# Altium schematic sheet PCB_TrafficLight - Copy.SchDoc
size A1; SheetNumber: 1; SheetTotal: 1; SPICEModelCacheFLOYLRYA: <root> / <DocumentId>FLOYLRYA</DocumentId> / <CacheFrame Number="0"> / <Model Name="hdsp_311a" Kind="CKT"> / <Text>* / * Diode Model Produced by Altium Ltd / * Date:  10-Mar-2004 / * / * Manufacturer: Agilent / * Component Name: HDSP-311A / * / * Parameters derived from information available in data sheet. / * / *                 cathode-A / *                 |  cathode-F / *                 |  |  common-anode / *                 |  |  |  cathode-E / *                 |  |  |  |  cathode-D / *                 |  |  |  |  |  cathode-DP / *                 |  |  |  |  |  |  cathode-C / *                 |  |  |  |  |  |  |  cathode-G / *                 |  |  |  |  |  |  |  |  cathode-B / *                 |  |  |  |  |  |  |  |  |  common-anode / *                 |  |  |  |  |  |  |  |  |  | / .SUBCKT HDSP_311A 1  2  3  7  8  9  10 11 13 14 / DA1   3  1 dHDSP_311A / DB1   3 13 dHDSP_311A / DC1   3 10 dHDSP_311A / DD1   3  8 dHDSP_311A / DE1   3  7 dHDSP_311A / DF1   3  2 dHDSP_311A / DG1   3 11 dHDSP_311A / DDP1  3  9 dHDSP_311A / DA2  14  1 dHDSP_311A / DB2  14 13 dHDSP_311A / DC2  14 10 dHDSP_311A / DD2  14  8 dHDSP_311A / DE2  14  7 dHDSP_311A / DF2  14  2 dHDSP_311A / DG2  14 11 dHDSP_311A / DDP2 14  9 dHDSP_311A / .MODEL dHDSP_311A D / + ( / +    IS  = 4.92088043E-22 / +     N  = 1.51994259 / +    RS  = 3.79496255 / +    BV  = 4.5 / +   IBV  = 100u / + ) / .ENDS HDSP_311A</Text> / </Model> / </CacheFrame> / </root>
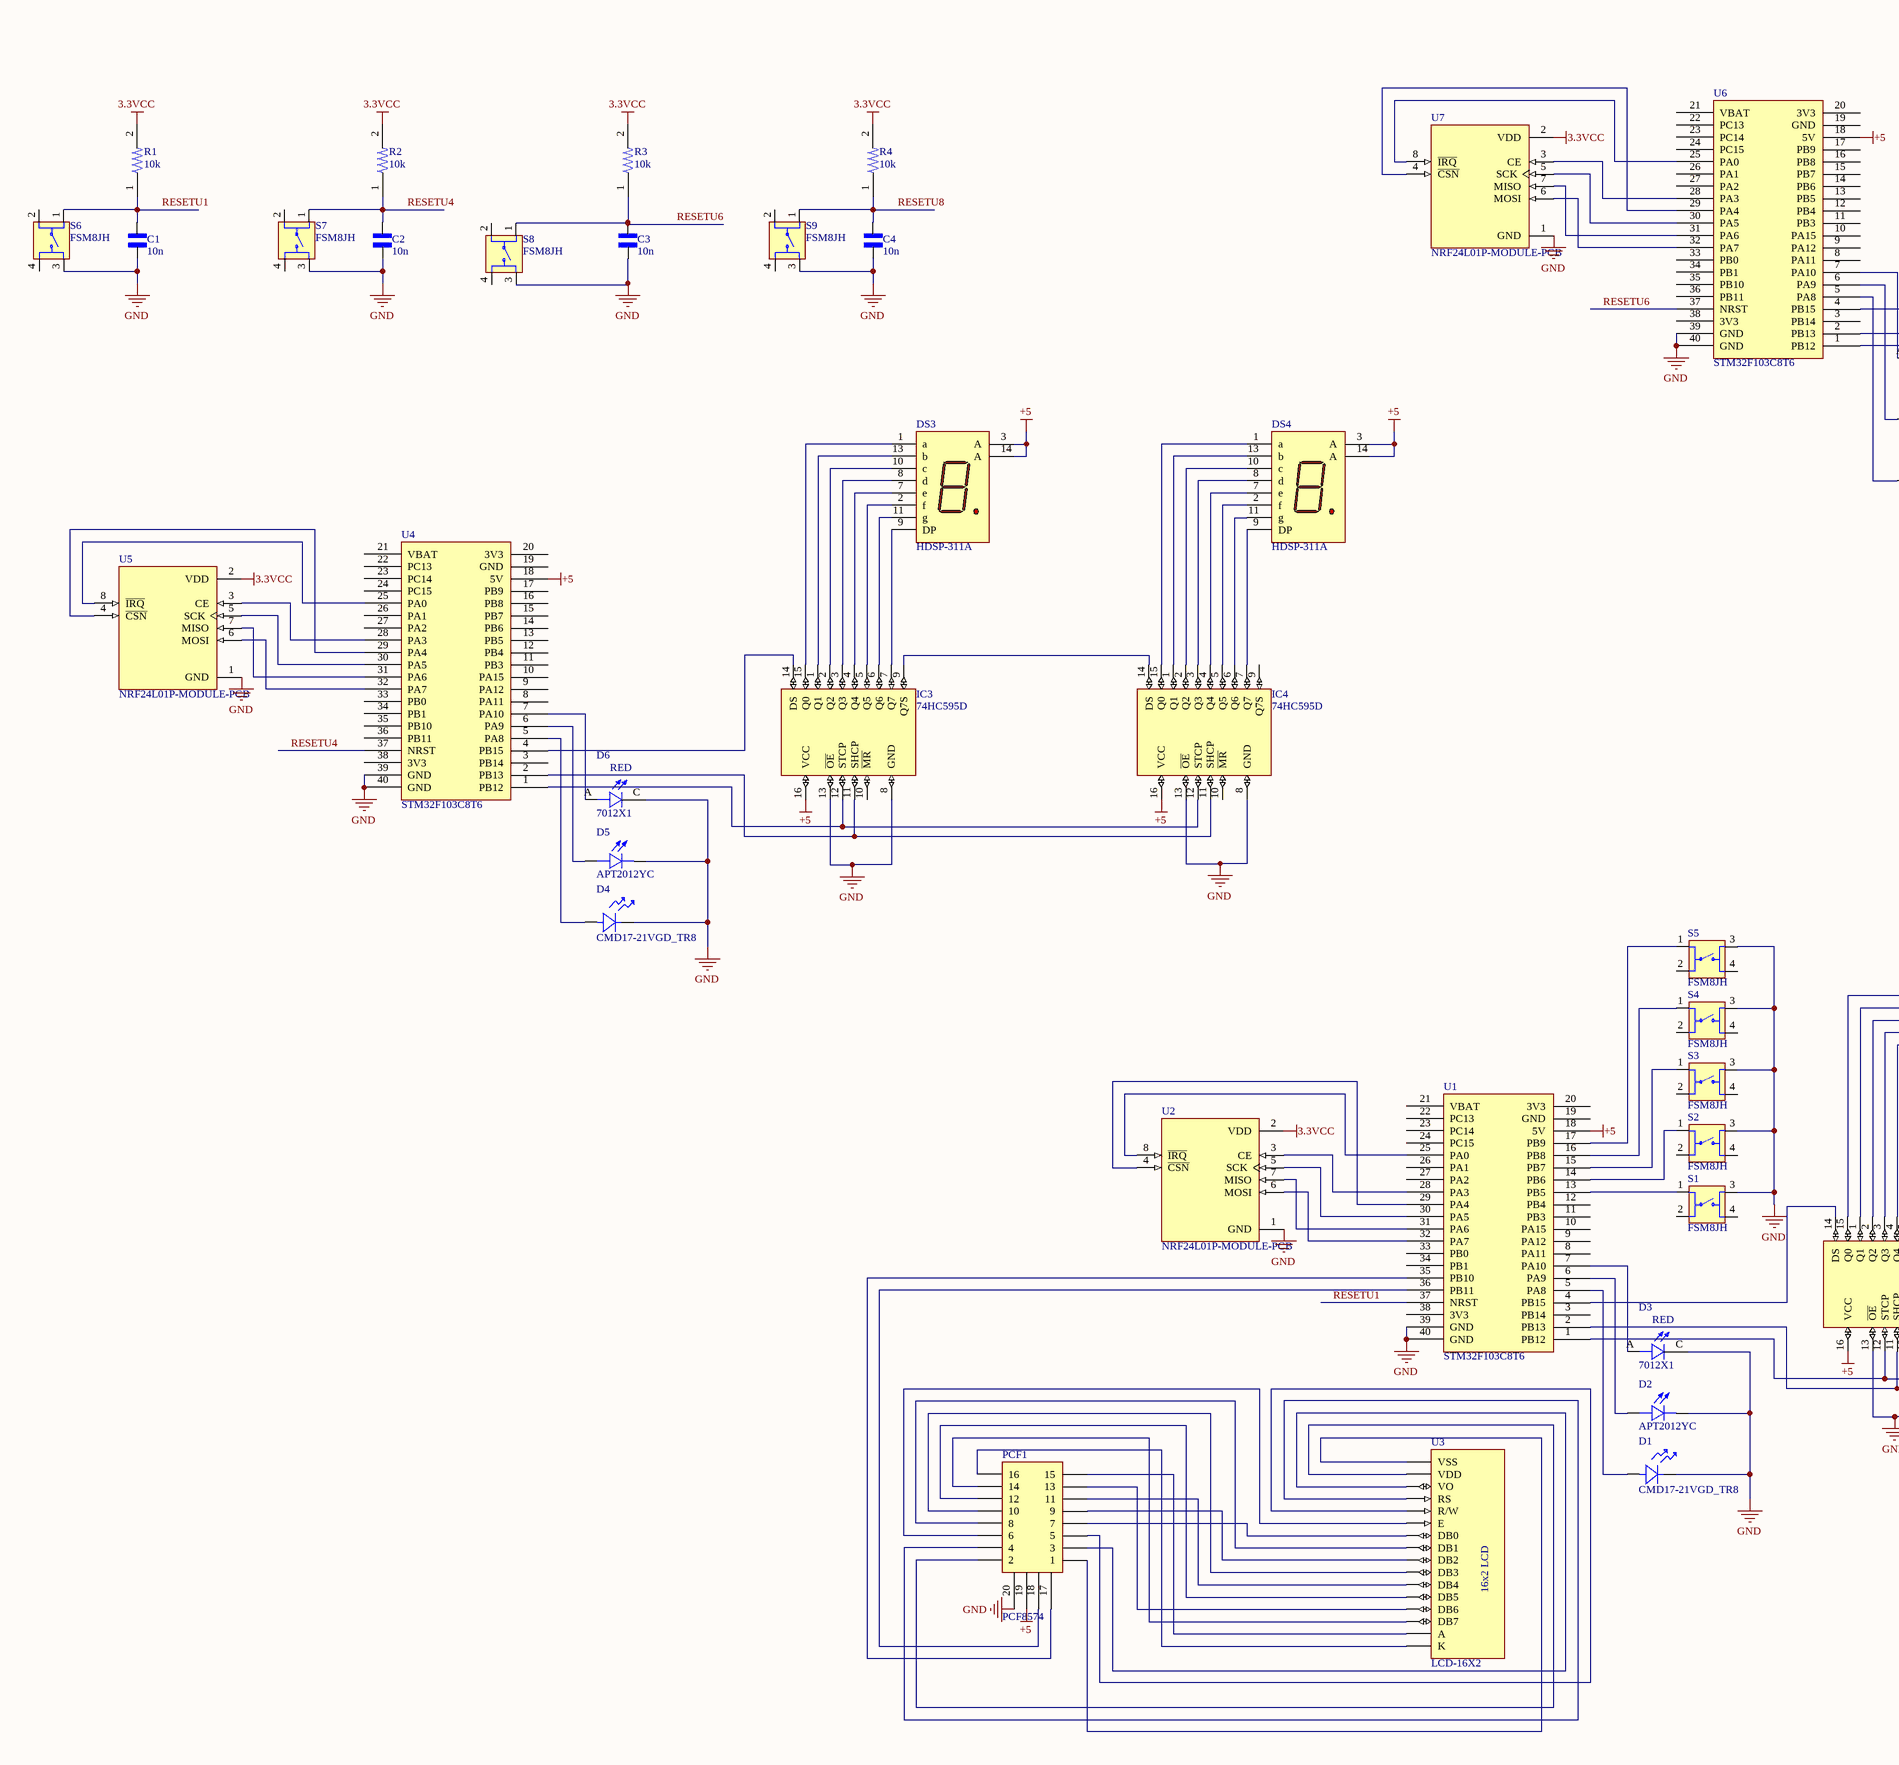
[diagram p0: PCB_TrafficLight - Copy.SchDoc, left]
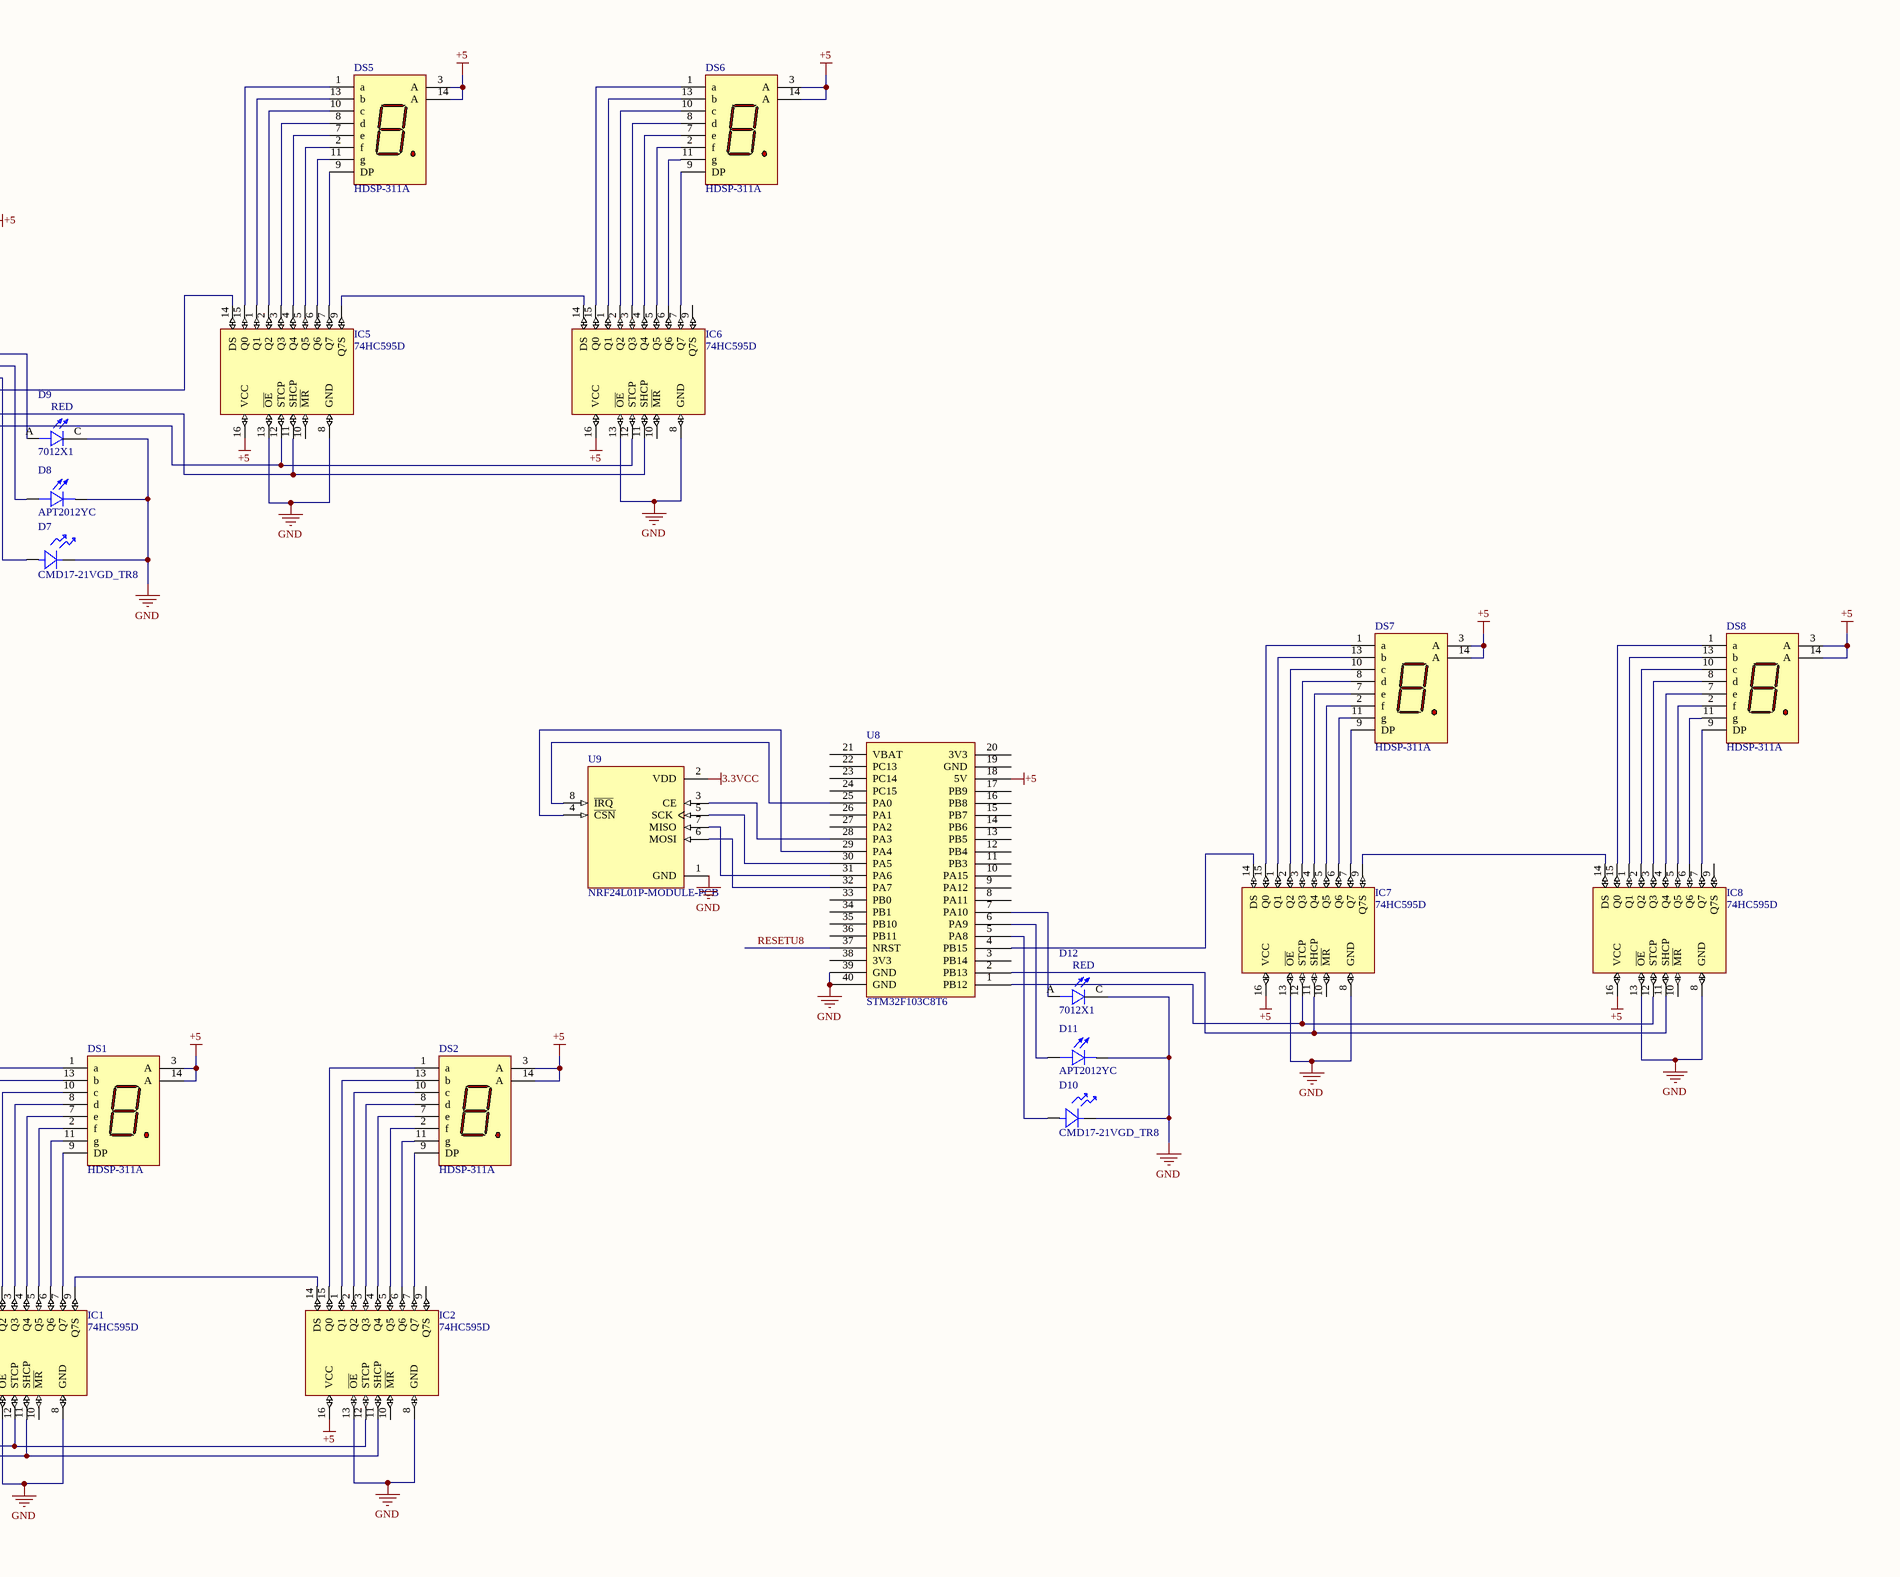
[diagram p1: PCB_TrafficLight - Copy.SchDoc, right]

## Parts
C1  10n  [CAPC1005X55N]
C2  10n  [CAPC1005X55N]
C3  10n  [CAPC1005X55N]
C4  10n  [CAPC1005X55N]
D1  CMD17-21VGD_TR8  [LED_CMD17-21VGD_TR8]
D2  APT2012YC  [LED_APT2012YC]
D3  7012X1  [LED_7012X1]
D4  CMD17-21VGD_TR8  [LED_CMD17-21VGD_TR8]
D5  APT2012YC  [LED_APT2012YC]
D6  7012X1  [LED_7012X1]
D7  CMD17-21VGD_TR8  [LED_CMD17-21VGD_TR8]
D8  APT2012YC  [LED_APT2012YC]
D9  7012X1  [LED_7012X1]
D10  CMD17-21VGD_TR8  [LED_CMD17-21VGD_TR8]
D11  APT2012YC  [LED_APT2012YC]
D12  7012X1  [LED_7012X1]
DS1  HDSP-311A  [F-10(14)]
DS2  HDSP-311A  [F-10(14)]
DS3  HDSP-311A  [F-10(14)]
DS4  HDSP-311A  [F-10(14)]
DS5  HDSP-311A  [F-10(14)]
DS6  HDSP-311A  [F-10(14)]
DS7  HDSP-311A  [F-10(14)]
DS8  HDSP-311A  [F-10(14)]
IC1  74HC595D  [SOIC127P600X175-16N]
IC2  74HC595D  [SOIC127P600X175-16N]
IC3  74HC595D  [SOIC127P600X175-16N]
IC4  74HC595D  [SOIC127P600X175-16N]
IC5  74HC595D  [SOIC127P600X175-16N]
IC6  74HC595D  [SOIC127P600X175-16N]
IC7  74HC595D  [SOIC127P600X175-16N]
IC8  74HC595D  [SOIC127P600X175-16N]
PCF1  PCF8574  [PCF8574]
R1  10k  [RESC1608X50N_CPF0603F10KC1]
R2  10k  [RESC1608X50N_CPF0603F10KC1]
R3  10k  [RESC1608X50N_CPF0603F10KC1]
R4  10k  [RESC1608X50N_CPF0603F10KC1]
S1  FSM8JH  [SW_FSM8JH]
S2  FSM8JH  [SW_FSM8JH]
S3  FSM8JH  [SW_FSM8JH]
S4  FSM8JH  [SW_FSM8JH]
S5  FSM8JH  [SW_FSM8JH]
S6  FSM8JH  [SW_FSM8JH]
S7  FSM8JH  [SW_FSM8JH]
S8  FSM8JH  [SW_FSM8JH]
S9  FSM8JH  [SW_FSM8JH]
U1  STM32F103C8T6  [Stm32 BluePill]
U2  NRF24L01P-MODULE-PCB  [XCVR_NRF24L01P-MODULE-PCB]
U3  LCD-16X2  [MODULE_LCD-16X2]
U4  STM32F103C8T6  [Stm32 BluePill]
U5  NRF24L01P-MODULE-PCB  [XCVR_NRF24L01P-MODULE-PCB]
U6  STM32F103C8T6  [Stm32 BluePill]
U7  NRF24L01P-MODULE-PCB  [XCVR_NRF24L01P-MODULE-PCB]
U8  STM32F103C8T6  [Stm32 BluePill]
U9  NRF24L01P-MODULE-PCB  [XCVR_NRF24L01P-MODULE-PCB]

## Nets
3.3VCC: R1.2 R2.2 R3.2 R4.2 U2.2(VDD) U5.2(VDD) U7.2(VDD) U9.2(VDD)
+5: DS1.3(A) DS1.14(A) DS2.3(A) DS2.14(A) DS3.3(A) DS3.14(A) DS4.3(A) DS4.14(A) DS5.3(A) DS5.14(A) DS6.3(A) DS6.14(A) DS7.3(A) DS7.14(A) DS8.3(A) DS8.14(A) IC1.16(VCC) IC2.16(VCC) IC3.16(VCC) IC4.16(VCC) IC5.16(VCC) IC6.16(VCC) IC7.16(VCC) IC8.16(VCC) PCF1.19 U1.18(5V) U4.18(5V) U6.18(5V) U8.18(5V)
GND: C1.1 C2.1 C3.1 C4.1 D1.2 D2.1(C) D3.C D4.2 D5.1(C) D6.C D7.2 D8.1(C) D9.C D10.2 D11.1(C) D12.C IC1.8(GND) IC1.13(~{OE}) IC2.8(GND) IC2.13(~{OE}) IC3.8(GND) IC3.13(~{OE}) IC4.8(GND) IC4.13(~{OE}) IC5.8(GND) IC5.13(~{OE}) IC6.8(GND) IC6.13(~{OE}) IC7.8(GND) IC7.13(~{OE}) IC8.8(GND) IC8.13(~{OE}) PCF1.20 S1.3 S2.3 S3.3 S4.3 S5.3 S6.3 S7.3 S8.3 S9.3 U1.39(GND) U1.40(GND) U2.1(GND) U4.39(GND) U4.40(GND) U5.1(GND) U6.39(GND) U6.40(GND) U7.1(GND) U8.39(GND) U8.40(GND) U9.1(GND)
RESETU1: C1.2 R1.1 S6.1 U1.37(NRST)
RESETU4: C2.2 R2.1 S7.1 U4.37(NRST)
RESETU6: C3.2 R3.1 S8.1 U6.37(NRST)
RESETU8: C4.2 R4.1 S9.1 U8.37(NRST)
NetD1_1: D1.1 U1.5(PA8)
NetD2_2: D2.2(A) U1.6(PA9)
NetD3_A: D3.A U1.7(PA10)
NetD4_1: D4.1 U4.5(PA8)
NetD5_2: D5.2(A) U4.6(PA9)
NetD6_A: D6.A U4.7(PA10)
NetD7_1: D7.1 U6.5(PA8)
NetD8_2: D8.2(A) U6.6(PA9)
NetD9_A: D9.A U6.7(PA10)
NetD10_1: D10.1 U8.5(PA8)
NetD11_2: D11.2(A) U8.6(PA9)
NetD12_A: D12.A U8.7(PA10)
NetDS1_1: DS1.1(a) IC1.15(Q0)
NetDS1_2: DS1.2(f) IC1.5(Q5)
NetDS1_7: DS1.7(e) IC1.4(Q4)
NetDS1_8: DS1.8(d) IC1.3(Q3)
NetDS1_9: DS1.9(DP) IC1.7(Q7)
NetDS1_10: DS1.10(c) IC1.2(Q2)
NetDS1_11: DS1.11(g) IC1.6(Q6)
NetDS1_13: DS1.13(b) IC1.1(Q1)
NetDS2_1: DS2.1(a) IC2.15(Q0)
NetDS2_2: DS2.2(f) IC2.5(Q5)
NetDS2_7: DS2.7(e) IC2.4(Q4)
NetDS2_8: DS2.8(d) IC2.3(Q3)
NetDS2_9: DS2.9(DP) IC2.7(Q7)
NetDS2_10: DS2.10(c) IC2.2(Q2)
NetDS2_11: DS2.11(g) IC2.6(Q6)
NetDS2_13: DS2.13(b) IC2.1(Q1)
NetDS3_1: DS3.1(a) IC3.15(Q0)
NetDS3_2: DS3.2(f) IC3.5(Q5)
NetDS3_7: DS3.7(e) IC3.4(Q4)
NetDS3_8: DS3.8(d) IC3.3(Q3)
NetDS3_9: DS3.9(DP) IC3.7(Q7)
NetDS3_10: DS3.10(c) IC3.2(Q2)
NetDS3_11: DS3.11(g) IC3.6(Q6)
NetDS3_13: DS3.13(b) IC3.1(Q1)
NetDS4_1: DS4.1(a) IC4.15(Q0)
NetDS4_2: DS4.2(f) IC4.5(Q5)
NetDS4_7: DS4.7(e) IC4.4(Q4)
NetDS4_8: DS4.8(d) IC4.3(Q3)
NetDS4_9: DS4.9(DP) IC4.7(Q7)
NetDS4_10: DS4.10(c) IC4.2(Q2)
NetDS4_11: DS4.11(g) IC4.6(Q6)
NetDS4_13: DS4.13(b) IC4.1(Q1)
NetDS5_1: DS5.1(a) IC5.15(Q0)
NetDS5_2: DS5.2(f) IC5.5(Q5)
NetDS5_7: DS5.7(e) IC5.4(Q4)
NetDS5_8: DS5.8(d) IC5.3(Q3)
NetDS5_9: DS5.9(DP) IC5.7(Q7)
NetDS5_10: DS5.10(c) IC5.2(Q2)
NetDS5_11: DS5.11(g) IC5.6(Q6)
NetDS5_13: DS5.13(b) IC5.1(Q1)
NetDS6_1: DS6.1(a) IC6.15(Q0)
NetDS6_2: DS6.2(f) IC6.5(Q5)
NetDS6_7: DS6.7(e) IC6.4(Q4)
NetDS6_8: DS6.8(d) IC6.3(Q3)
NetDS6_9: DS6.9(DP) IC6.7(Q7)
NetDS6_10: DS6.10(c) IC6.2(Q2)
NetDS6_11: DS6.11(g) IC6.6(Q6)
NetDS6_13: DS6.13(b) IC6.1(Q1)
NetDS7_1: DS7.1(a) IC7.15(Q0)
NetDS7_2: DS7.2(f) IC7.5(Q5)
NetDS7_7: DS7.7(e) IC7.4(Q4)
NetDS7_8: DS7.8(d) IC7.3(Q3)
NetDS7_9: DS7.9(DP) IC7.7(Q7)
NetDS7_10: DS7.10(c) IC7.2(Q2)
NetDS7_11: DS7.11(g) IC7.6(Q6)
NetDS7_13: DS7.13(b) IC7.1(Q1)
NetDS8_1: DS8.1(a) IC8.15(Q0)
NetDS8_2: DS8.2(f) IC8.5(Q5)
NetDS8_7: DS8.7(e) IC8.4(Q4)
NetDS8_8: DS8.8(d) IC8.3(Q3)
NetDS8_9: DS8.9(DP) IC8.7(Q7)
NetDS8_10: DS8.10(c) IC8.2(Q2)
NetDS8_11: DS8.11(g) IC8.6(Q6)
NetDS8_13: DS8.13(b) IC8.1(Q1)
NetIC1_9: IC1.9(Q7S) IC2.14(DS)
NetIC1_11: IC1.11(SHCP) IC2.11(SHCP) U1.2(PB13)
NetIC1_12: IC1.12(STCP) IC2.12(STCP) U1.1(PB12)
NetIC1_14: IC1.14(DS) U1.4(PB15)
NetIC3_9: IC3.9(Q7S) IC4.14(DS)
NetIC3_11: IC3.11(SHCP) IC4.11(SHCP) U4.2(PB13)
NetIC3_12: IC3.12(STCP) IC4.12(STCP) U4.1(PB12)
NetIC3_14: IC3.14(DS) U4.4(PB15)
NetIC5_9: IC5.9(Q7S) IC6.14(DS)
NetIC5_11: IC5.11(SHCP) IC6.11(SHCP) U6.2(PB13)
NetIC5_12: IC5.12(STCP) IC6.12(STCP) U6.1(PB12)
NetIC5_14: IC5.14(DS) U6.4(PB15)
NetIC7_9: IC7.9(Q7S) IC8.14(DS)
NetIC7_11: IC7.11(SHCP) IC8.11(SHCP) U8.2(PB13)
NetIC7_12: IC7.12(STCP) IC8.12(STCP) U8.1(PB12)
NetIC7_14: IC7.14(DS) U8.4(PB15)
NetPCF1_1: PCF1.1 U3.1(VSS)
NetPCF1_2: PCF1.2 U3.2(VDD)
NetPCF1_3: PCF1.3 U3.3(VO)
NetPCF1_4: PCF1.4 U3.4(RS)
NetPCF1_5: PCF1.5 U3.5(R/W)
NetPCF1_6: PCF1.6 U3.6(E)
NetPCF1_7: PCF1.7 U3.7(DB0)
NetPCF1_8: PCF1.8 U3.8(DB1)
NetPCF1_9: PCF1.9 U3.9(DB2)
NetPCF1_10: PCF1.10 U3.10(DB3)
NetPCF1_11: PCF1.11 U3.11(DB4)
NetPCF1_12: PCF1.12 U3.12(DB5)
NetPCF1_13: PCF1.13 U3.13(DB6)
NetPCF1_14: PCF1.14 U3.14(DB7)
NetPCF1_15: PCF1.15 U3.15(A)
NetPCF1_16: PCF1.16 U3.16(K)
NetPCF1_17: PCF1.17 U1.35(PB10)
NetPCF1_18: PCF1.18 U1.36(PB11)
NetS1_1: S1.1 U1.13(PB5)
NetS2_1: S2.1 U1.14(PB6)
NetS3_1: S3.1 U1.15(PB7)
NetS4_1: S4.1 U1.16(PB8)
NetS5_1: S5.1 U1.17(PB9)
NetU1_25: U1.25(PA0) U2.8(~{IRQ})
NetU1_28: U1.28(PA3) U2.3(CE)
NetU1_29: U1.29(PA4) U2.4(~{CSN})
NetU1_30: U1.30(PA5) U2.5(SCK)
NetU1_31: U1.31(PA6) U2.7(MISO)
NetU1_32: U1.32(PA7) U2.6(MOSI)
NetU4_25: U4.25(PA0) U5.8(~{IRQ})
NetU4_28: U4.28(PA3) U5.3(CE)
NetU4_29: U4.29(PA4) U5.4(~{CSN})
NetU4_30: U4.30(PA5) U5.5(SCK)
NetU4_31: U4.31(PA6) U5.7(MISO)
NetU4_32: U4.32(PA7) U5.6(MOSI)
NetU6_25: U6.25(PA0) U7.8(~{IRQ})
NetU6_28: U6.28(PA3) U7.3(CE)
NetU6_29: U6.29(PA4) U7.4(~{CSN})
NetU6_30: U6.30(PA5) U7.5(SCK)
NetU6_31: U6.31(PA6) U7.7(MISO)
NetU6_32: U6.32(PA7) U7.6(MOSI)
NetU8_25: U8.25(PA0) U9.8(~{IRQ})
NetU8_28: U8.28(PA3) U9.3(CE)
NetU8_29: U8.29(PA4) U9.4(~{CSN})
NetU8_30: U8.30(PA5) U9.5(SCK)
NetU8_31: U8.31(PA6) U9.7(MISO)
NetU8_32: U8.32(PA7) U9.6(MOSI)

Not connected (* = marked no-connect by the designer): IC1 10(~{MR}); IC2 9(Q7S) 10(~{MR}); IC3 10(~{MR}); IC4 9(Q7S) 10(~{MR}); IC5 10(~{MR}); IC6 9(Q7S) 10(~{MR}); IC7 10(~{MR}); IC8 9(Q7S) 10(~{MR}); S1 2 4; S2 2 4; S3 2 4; S4 2 4; S5 2 4; S6 2 4; S7 2 4; S8 2 4; S9 2 4; U1 3(PB14) 8(PA11) 9(PA12) 10(PA15) 11(PB3) 12(PB4) 19(GND) 20(3V3) 21(VBAT) 22(PC13) 23(PC14) 24(PC15) 26(PA1) 27(PA2) 33(PB0) 34(PB1) 38(3V3); U4 3(PB14) 8(PA11) 9(PA12) 10(PA15) 11(PB3) 12(PB4) 13(PB5) 14(PB6) 15(PB7) 16(PB8) 17(PB9) 19(GND) 20(3V3) 21(VBAT) 22(PC13) 23(PC14) 24(PC15) 26(PA1) 27(PA2) 33(PB0) 34(PB1) 35(PB10) 36(PB11) 38(3V3); U6 3(PB14) 8(PA11) 9(PA12) 10(PA15) 11(PB3) 12(PB4) 13(PB5) 14(PB6) 15(PB7) 16(PB8) 17(PB9) 19(GND) 20(3V3) 21(VBAT) 22(PC13) 23(PC14) 24(PC15) 26(PA1) 27(PA2) 33(PB0) 34(PB1) 35(PB10) 36(PB11) 38(3V3); U8 3(PB14) 8(PA11) 9(PA12) 10(PA15) 11(PB3) 12(PB4) 13(PB5) 14(PB6) 15(PB7) 16(PB8) 17(PB9) 19(GND) 20(3V3) 21(VBAT) 22(PC13) 23(PC14) 24(PC15) 26(PA1) 27(PA2) 33(PB0) 34(PB1) 35(PB10) 36(PB11) 38(3V3)

## Notes on the sheet
- (in symbol 7012X1) RED
- (in symbol LCD-16X2) 16x2 LCD

## Library data of the parts
C1-C4 = GCM155R11H103KA40D: Multilayer Ceramic Capacitors MLCC - SMD/SMT; MF: Murata; SnapEDA_Link: https://www.snapeda.com/parts/GCM155R11H103KA40D/Murata/view-part/?ref=snap; Package: 1005 Taiyo Yuden; Value: *; MP: GCM155R11H103KA40D; Check_prices: https://www.snapeda.com/parts/GCM155R11H103KA40D/Murata/view-part/?ref=eda
D1 D4 D7 D10 = CMD17-21VGD_TR8: Green - LED Indication - Discrete 2.1V 0805 (2012 Metric); MF: VCC; MP: CMD17-21VGD/TR8; SnapEDA_Link: https://www.snapeda.com/parts/CMD17-21VGD/TR8/VCC/view-part/?ref=snap; Package: 0805 Visual Communications; Value: *; Check_prices: https://www.snapeda.com/parts/CMD17-21VGD/TR8/VCC/view-part/?ref=eda
D2 D5 D8 D11 = APT2012YC: MF: {'manufacturer': u'Kingbright'}; Package: None; Price: None; Value: *; MP: APT2012YC; Availability: Unavailable
D3 D6 D9 D12 = 7012X1: Red - LED Indication - Discrete 1.7V 0805 (2012 Metric); MF: VCC; Package: 0805 Visual Communications; Purchase-URL: https://pricing.snapeda.com/search/part/7012X1/?ref=eda; MP: 7012X1; Value: *; Availability: In Stock; SnapEDA_Link: https://www.snapeda.com/parts/7012X1/Visual+Communications/view-part/?ref=snap; Price: None; Check_prices: https://www.snapeda.com/parts/7012X1/Visual+Communications/view-part/?ref=eda
DS1-DS8 = HDSP-311A: 10.16 mm Single Digit General Purpose AlGaAs Red 7-Segment Display: CA, RH DP; LuminousIntensity: 3200 ucd (Minimum).; Note: No pins are present in positions 4, 5, 6 and 12.; Published: 26-May-2004; LatestRevisionDate: 11-Oct-2004; LatestRevisionNote: Display outline superimposed on PCB Footprint.; DatasheetDocument: 20-Aug-2001; PackageDocument: 20-Aug-2001; PackageReference: F-10(14); Publisher: Altium Limited; LED_Colour: AlGaAs Red; ComponentLink1Description: Manufacturer Link; ComponentLink1URL: http://www.agilent.com/; ComponentLink2Description: Datasheet; ComponentLink2URL: http://cp.literature.agilent.com/litweb/pdf/5988-2969EN.pdf
IC1-IC8 = 74HC595D: Shift Register Single 8-Bit Serial to Serial/Parallel 16-Pin SOIC T/R; MF: NXP Semiconductors; SnapEDA_Link: https://www.snapeda.com/parts/74HC595D/NXP+Semiconductors/view-part/?ref=snap; Package: SOIC-16 ON Semiconductor; Value: *; MP: 74HC595D; Check_prices: https://www.snapeda.com/parts/74HC595D/NXP+Semiconductors/view-part/?ref=eda
R1-R4 = CPF0603F10KC1: Res Thin Film 0603 10K Ohm 1% 1/16W Â±50ppm/Â°C Molded SMD SMD Paper T/R; MF: TE Connectivity; Voltage_Rating: 50 V; Power_Rating: .063 W; Tolerance: 1%; Price: None; SnapEDA_Link: https://www.snapeda.com/parts/CPF0603F10KC1/TE+Connectivity+Passive+Product/view-part/?ref=snap; Resistance: 10K; Check_prices: https://www.snapeda.com/parts/CPF0603F10KC1/TE+Connectivity+Passive+Product/view-part/?ref=eda; EU_RoHS_Compliance: Compliant; Purchase-URL: https://pricing.snapeda.com/search/part/CPF0603F10KC1/?ref=eda; Availability: In Stock; Package: 0603; MP: CPF0603F10KC1; Value: *
S1-S9 = FSM8JH: Tactile Switch SPST-NO Top Actuated Through Hole; MF: TE Connectivity; Check_prices: https://www.snapeda.com/parts/FSM8JH/TE+Connectivity+ALCOSWITCH+Switches/view-part/?ref=eda; Value: *; Availability: In Stock; MP: FSM8JH; Price: None; Package: None; SnapEDA_Link: https://www.snapeda.com/parts/FSM8JH/TE+Connectivity+ALCOSWITCH+Switches/view-part/?ref=snap
U1 U4 U6 U8 = BluePill: Designed By @Alixahedi
U2 U5 U7 U9 = NRF24L01P-MODULE-PCB: - Transceiver For Use With nRF24L01+; MF: Nordic Semiconductor; Package: None; MP: NRF24L01P-MODULE-PCB; Value: *; Availability: Bad; Price: None; SnapEDA_Link: https://www.snapeda.com/parts/NRF24L01P-MODULE-PCB/Nordic%20Semiconductor%20ASA/view-part/230534/?ref=snap; Mouser-Purchase-URL: https://snapeda.com/shop?store=Mouser&id=230534
U3 = LCD-16X2: Display Development Tools 16x2 Black on Green Char LCD w Backlight; MF: Gravitech; SnapEDA_Link: https://www.snapeda.com/parts/LCD-16X2/Gravitech/view-part/?ref=snap; Package: None; Value: *; MP: LCD-16X2; Check_prices: https://www.snapeda.com/parts/LCD-16X2/Gravitech/view-part/?ref=eda